# Altium schematic sheet Stm32f407 controller.SchDoc
size A; SheetNumber: 9; SheetTotal: 9
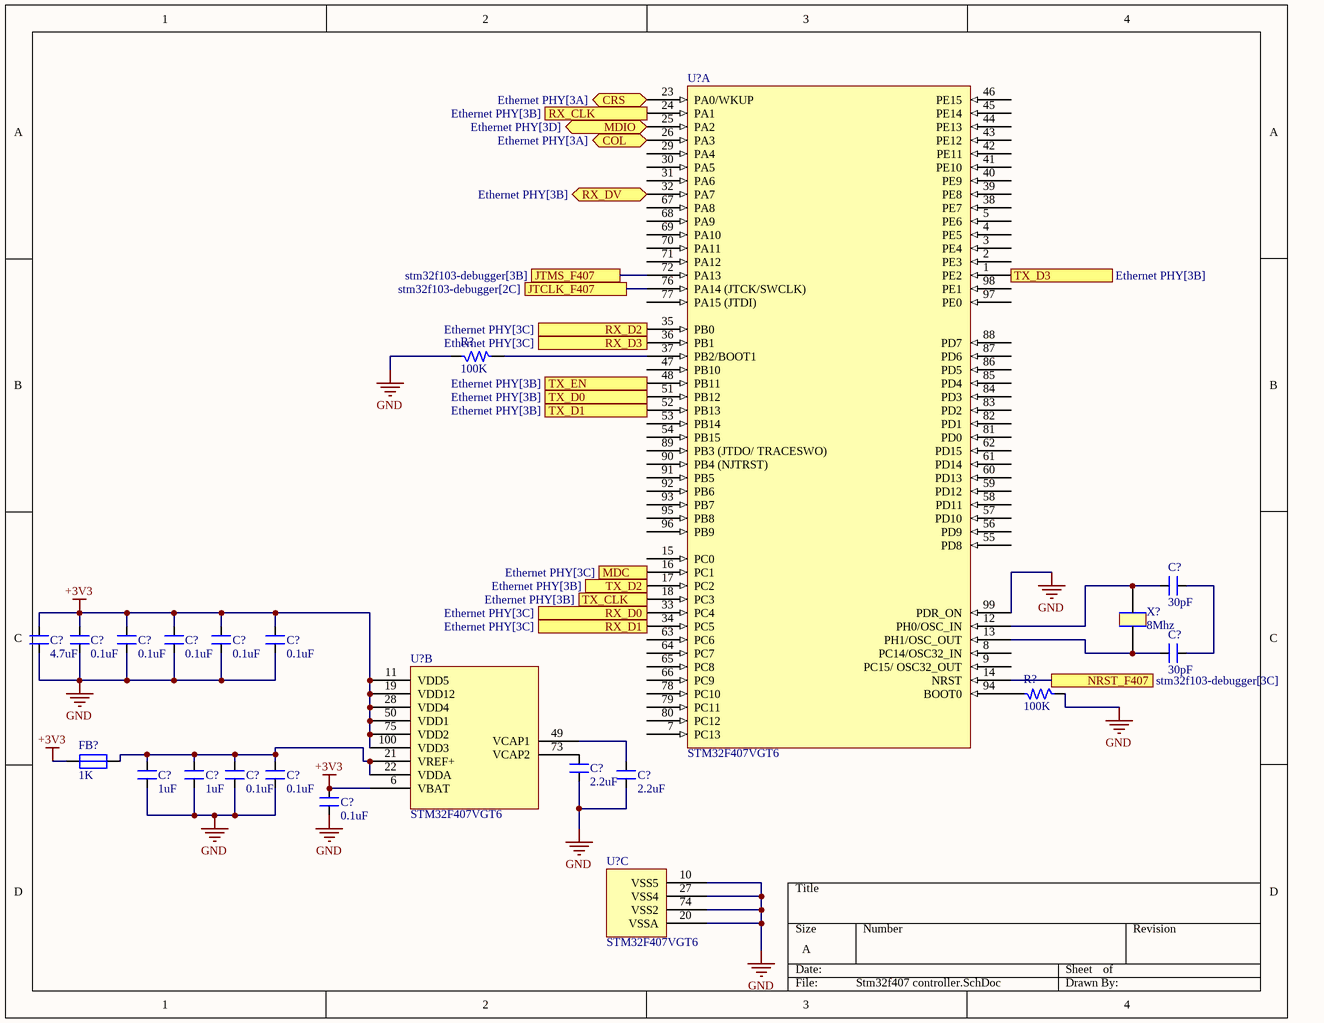
[diagram p0: Stm32f407 controller.SchDoc]

## Parts
(Parts that share a designator on the sheet are numbered #1, #2 ... from top to bottom, then left to right.)
C?#1  30pF  [CAP_0805]
C?#2  4.7uF  [CAP_0805]
C?#3  0.1uF  [CAP_0805]
C?#4  0.1uF  [CAP_0805]
C?#5  0.1uF  [CAP_0805]
C?#6  0.1uF  [CAP_0805]
C?#7  0.1uF  [CAP_0805]
C?#8  30pF  [CAP_0805]
C?#9  2.2uF  [CAP_0805]
C?#10  1uF  [CAP_0805]
C?#11  1uF  [CAP_0805]
C?#12  0.1uF  [CAP_0805]
C?#13  0.1uF  [CAP_0805]
C?#14  2.2uF  [CAP_0805]
C?#15  0.1uF  [CAP_0805]
FB?  1K  [IND_0805]
R?#1  100K  [RES_0603]
R?#2  100K  [RES_0603]
U?#1  STM32F407VGT6  [QFN100_19.6_669_58X10_SMD]  (part A of 3)
U?#2  STM32F407VGT6  [QFN100_19.6_669_58X10_SMD]  (part B of 3)
U?#3  STM32F407VGT6  [QFN100_19.6_669_58X10_SMD]  (part C of 3)
X?  8Mhz  [XTAL_314_240X47_SMD]

## Ports
COL (bidir, see Ethernet PHY[3A]), CRS (bidir, see Ethernet PHY[3A]), JTCLK_F407 (see stm32f103-debugger[2C]), JTMS_F407 (see stm32f103-debugger[3B]), MDC (out, see Ethernet PHY[3C]), MDIO (bidir, see Ethernet PHY[3D]), NRST_F407 (see stm32f103-debugger[3C]), RX_CLK (in, see Ethernet PHY[3B]), RX_D0 (out, see Ethernet PHY[3C]), RX_D1 (out, see Ethernet PHY[3C]), RX_D2 (out, see Ethernet PHY[3C]), RX_D3 (out, see Ethernet PHY[3C]), RX_DV (bidir, see Ethernet PHY[3B]), TX_CLK (out, see Ethernet PHY[3B]), TX_D0 (in, see Ethernet PHY[3B]), TX_D1 (in, see Ethernet PHY[3B]), TX_D2 (out, see Ethernet PHY[3B]), TX_D3 (in, see Ethernet PHY[3B]), TX_EN (in, see Ethernet PHY[3B])

## Nets
+3V3: C?#2.2 C?#3.2 C?#4.2 C?#5.2 C?#6.2 C?#7.2 C?#15.2 FB?.1 U?#2.6(VBAT) U?#2.11(VDD5) U?#2.19(VDD12) U?#2.28(VDD4) U?#2.50(VDD1) U?#2.75(VDD2) U?#2.100(VDD3)
GND: C?#2.1 C?#3.1 C?#4.1 C?#5.1 C?#6.1 C?#7.1 C?#9.1 C?#10.1 C?#11.1 C?#12.1 C?#13.1 C?#14.1 C?#15.1 R?#1.1 R?#2.1 U?#1.99(PDR_ON) U?#3.10(VSS5) U?#3.20(VSSA) U?#3.27(VSS4) U?#3.74(VSS2)
COL: U?#1.26(PA3) ; port COL
CRS: U?#1.23(PA0/WKUP) ; port CRS
JTCLK_F407: U?#1.76(PA14_(JTCK/SWCLK)) ; port JTCLK_F407
JTMS_F407: U?#1.72(PA13) ; port JTMS_F407
MDC: U?#1.16(PC1) ; port MDC
MDIO: U?#1.25(PA2) ; port MDIO
NRST_F407: U?#1.14(NRST) ; port NRST_F407
RX_CLK: U?#1.24(PA1) ; port RX_CLK
RX_D0: U?#1.33(PC4) ; port RX_D0
RX_D1: U?#1.34(PC5) ; port RX_D1
RX_D2: U?#1.35(PB0) ; port RX_D2
RX_D3: U?#1.36(PB1) ; port RX_D3
RX_DV: U?#1.32(PA7) ; port RX_DV
TX_CLK: U?#1.18(PC3) ; port TX_CLK
TX_D0: U?#1.51(PB12) ; port TX_D0
TX_D1: U?#1.52(PB13) ; port TX_D1
TX_D2: U?#1.17(PC2) ; port TX_D2
TX_D3: U?#1.1(PE2) ; port TX_D3
TX_EN: U?#1.48(PB11) ; port TX_EN
NetC?#1_1: C?#1.1 U?#1.12(PH0/OSC_IN) X?.2
NetC?#1_2: C?#1.2 C?#8.2
NetC?#8_1: C?#8.1 U?#1.13(PH1/OSC_OUT) X?.1
NetC?#9_2: C?#9.2 U?#2.73(VCAP2)
NetC?#10_2: C?#10.2 C?#11.2 C?#12.2 C?#13.2 FB?.2 U?#2.21(VREF+) U?#2.22(VDDA)
NetC?#14_2: C?#14.2 U?#2.49(VCAP1)
NetR?#1_2: R?#1.2 U?#1.37(PB2/BOOT1)
NetR?#2_2: R?#2.2 U?#1.94(BOOT0)

Not connected (* = marked no-connect by the designer): U?#1 2(PE3) 3(PE4) 4(PE5) 5(PE6) 7(PC13) 8(PC14/OSC32_IN) 9(PC15/_OSC32_OUT) 15(PC0) 29(PA4) 30(PA5) 31(PA6) 38(PE7) 39(PE8) 40(PE9) 41(PE10) 42(PE11) 43(PE12) 44(PE13) 45(PE14) 46(PE15) 47(PB10) 53(PB14) 54(PB15) 55(PD8) 56(PD9) 57(PD10) 58(PD11) 59(PD12) 60(PD13) 61(PD14) 62(PD15) 63(PC6) 64(PC7) 65(PC8) 66(PC9) 67(PA8) 68(PA9) 69(PA10) 70(PA11) 71(PA12) 77(PA15_(JTDI)) 78(PC10) 79(PC11) 80(PC12) 81(PD0) 82(PD1) 83(PD2) 84(PD3) 85(PD4) 86(PD5) 87(PD6) 88(PD7) 89(PB3_(JTDO/_TRACESWO)) 90(PB4_(NJTRST)) 91(PB5) 92(PB6) 93(PB7) 95(PB8) 96(PB9) 97(PE0) 98(PE1)

## Library data of the parts
C?#1 C?#8 = CAP_30pF-50V-10%-0805: ±10% 50V Ceramic Capacitor C0G, NP0 0805 (2012 Metric); Manufacturer Part Number: C0805C300K5GAC7800; Manufacturer: KEMET; Alternate Part Number: NA; Case/Package: 0805; Supplier-1: Digikey; Supplier Part Number-1: 399-17443-1-ND - Cut Tape (CT)
C?#2 = CAP_4.7uF-50V-10%-0805: 4.7µF ±10% 50V Ceramic Capacitor X5R 0805 (2012 Metric); Manufacturer: Yageo; Manufacturer Part Number: GRM21BR61H475KE51L; Alternate Part Number-1: NA; Case/Package: 0805; Supplier-1: SIRICOM; Supplier Part Number-1: CL21A475KBQNNNE
C?#3-C?#7 C?#12 C?#13 C?#15 = CAP_0.1uF-50V-5%-0805: 0.1µF ±5% 50V Ceramic Capacitor X7R 0805 (2012 Metric); Manufacturer: AVX Corporation; Manufacturer Part Number: 08055C104JAT4A; Alternate Part Number-1: 0805B104M500; Case/Package: 0805; Supplier-1: SIRICOM; Supplier Part Number-1: 0805B104J500CT
C?#9 C?#14 = CAP_2.2uF-25V-10%-0805: 2.2µF ±10% 25V Ceramic Capacitor X7R 0805 (2012 Metric); Manufacturer: KEMET; Manufacturer Part Number: CL21B225KAFNFNE; Alternate Part Number-1: NA; Case/Package: 0805; Supplier-1: SIRICOM; Supplier Part Number-1: CL21A225KAFNNNE
C?#10 C?#11 = CAP_1uF-50V-5%-0805: 1µF ±5% 50V Ceramic Capacitor X7R 0805 (2012 Metric); Manufacturer: Samsung; Manufacturer Part Number: CC0805JKX7R9BB105; Alternate Part Number-1: 0805F105M500NT; Case/Package: 0805; Supplier-1: SIRICOM; Supplier Part Number-1: CL21B105KBFNNNE
FB? = FB_1K-100MHZ-1.6A-0805: 1 kOhms @ 100MHz 1 Power Line Ferrite Bead 0805 (2012 Metric) 1.6A; Manufacturer: Laird; Manufacturer Part Number: BLM21SP102SH1D; Alternate Part Number-1: NA; Case/Package: 0805; Supplier-1: SIRICOM; Supplier Part Number-1: ACMS201209A102
R?#1 R?#2 = RES_100K-0.1W-1%-0603: 100 kOhms ±1% 0.1W, 1/10W Chip Resistor 0603 (1608 Metric) Automotive AEC-Q200 Thick Film; Manufacturer: Stackpole Electronics; Manufacturer Part Number: RMCF0603FT100K; Alternate Part Number-1: NA; Case/Package: 0603; Supplier-1: Arrow; Supplier Part Number-1: RMCF0603FT100K
U?#1-U?#3 = IC_STM32F407VGT6: ARM® Cortex®-M4 STM32F4 Microcontroller IC 32-Bit 168MHz 1MB (1M x 8) FLASH 100-LQFP (14x14); Manufacturer: STMicroelectronics; Alternate Part Number-1: STM32F407VET6; Manufacturer Part Number: STM32F407VGT6; Case/Package: LQFP100; Supplier-1: ARROW; Supplier Part Number-1: STM32F407VGT6
X? = XTAL_8MHZ-ECS-80-32-5PX-SMD: 8MHz ±30ppm Crystal 32pF 60 Ohms HC-49/US; Manufacturer: Fox Electronics; Manufacturer Part Number: ECS-80-32-5PX-TR; Alternate Part Number-1: NA; Case/Package: SMD/SMT; Supplier-1: SP ROAD; Supplier Part Number-1: ECS-80-32-5PX-TR